# EAGLE design EdisonCandle (EAGLE 8.1.0)
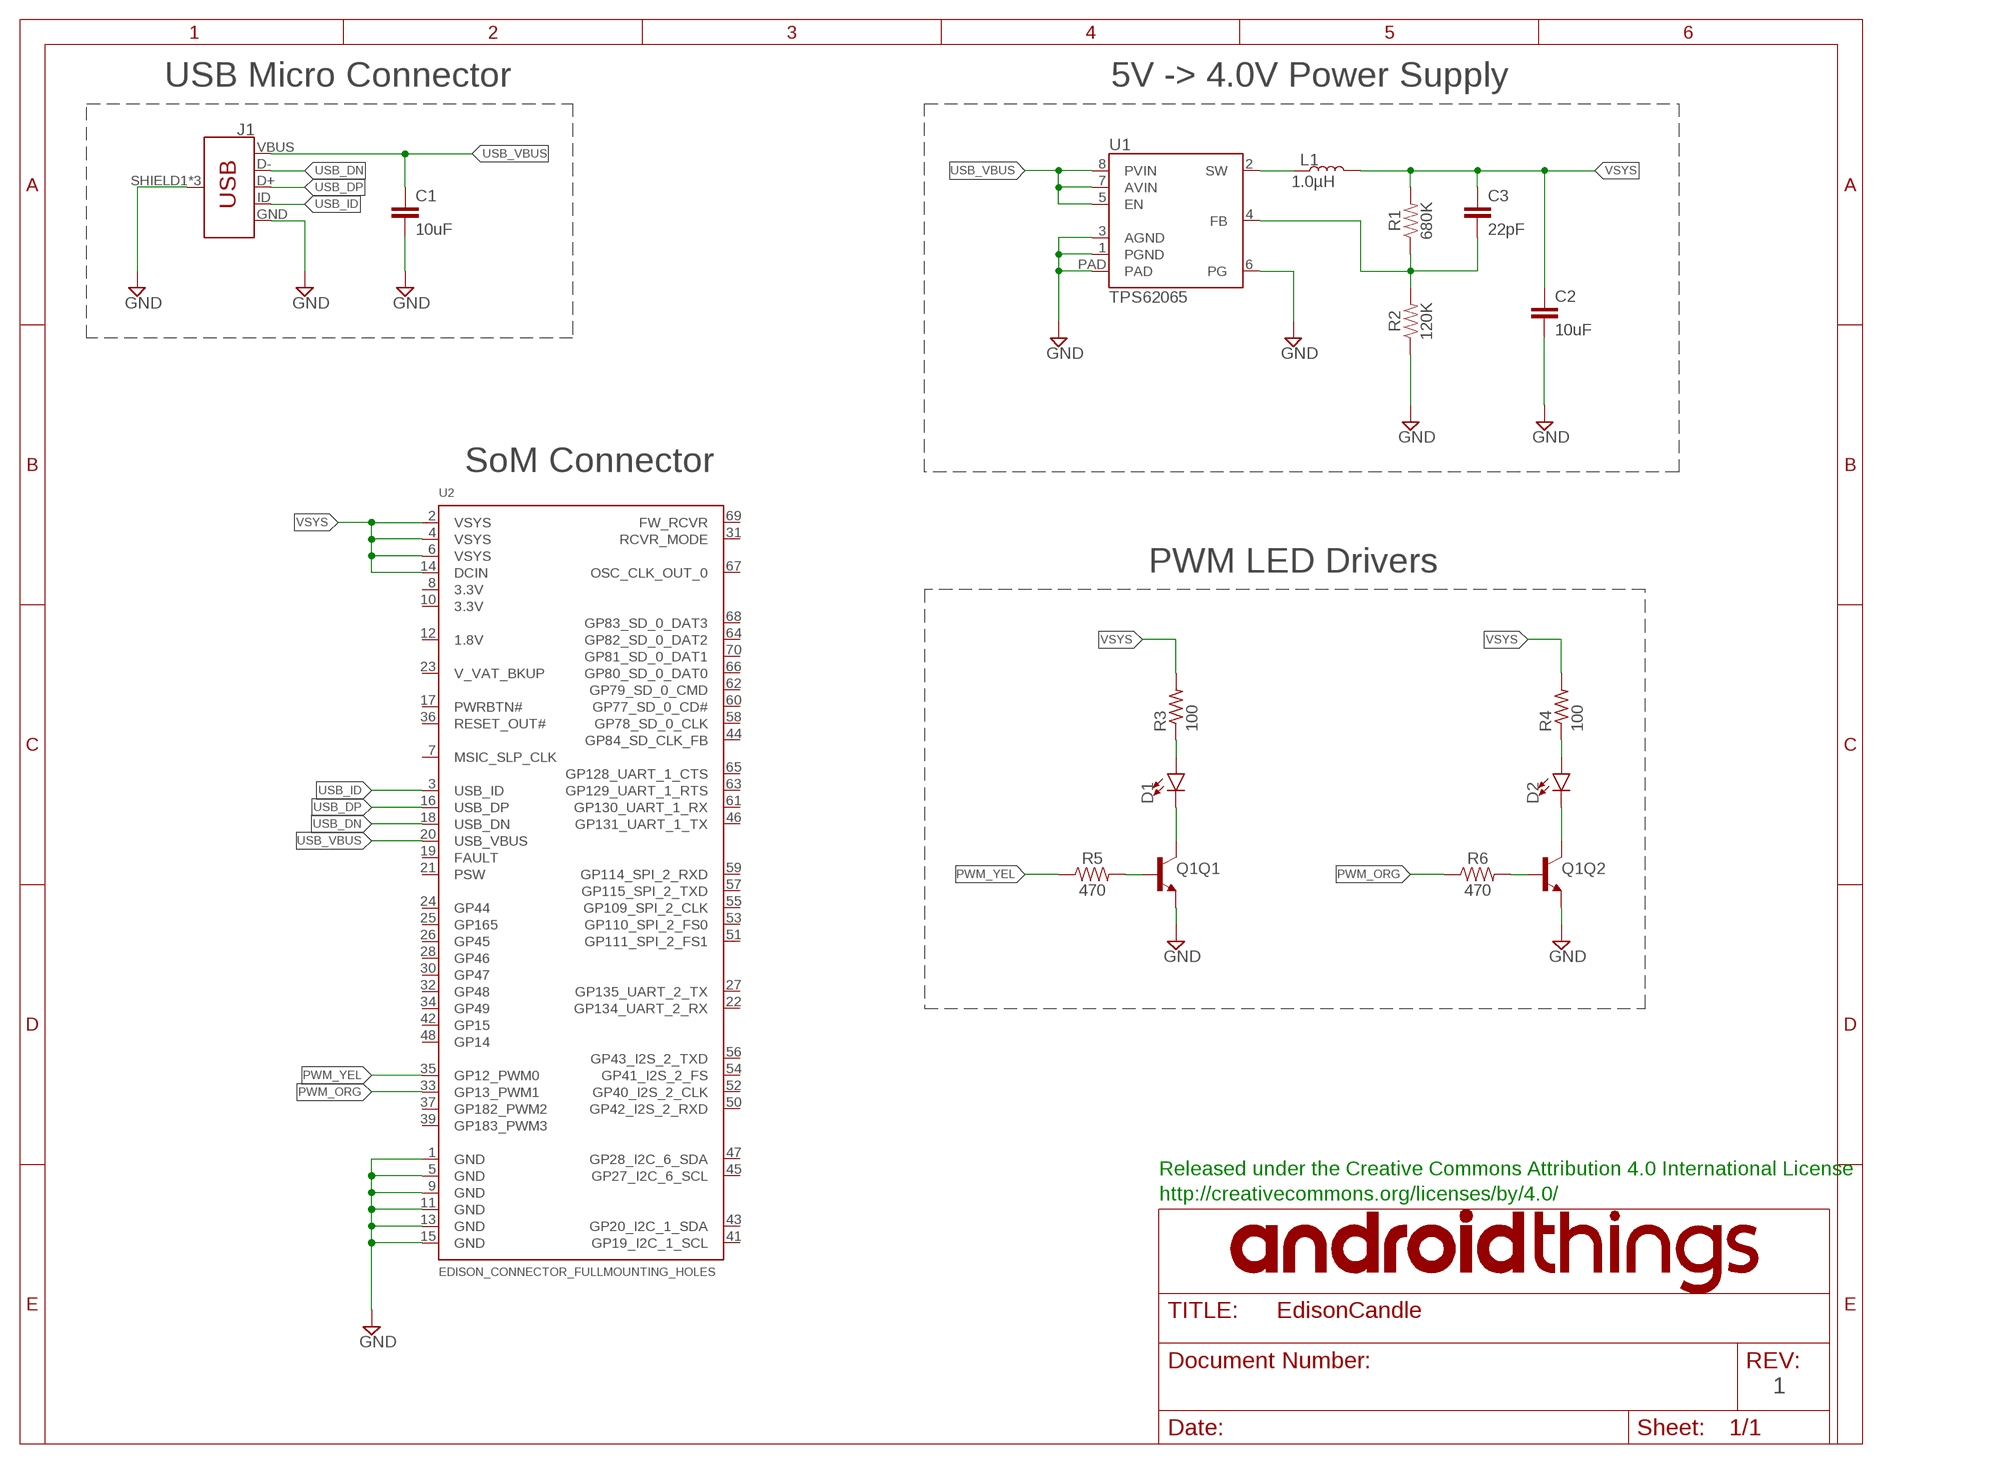
[diagram p0: schematic, sheet 1]

## Parts
C1  10uF  10UF-0805-10V-10%  [0805]
C2  10uF  10UF-0805-10V-10%  [0805]
C3  22pF  22PF-0603-50V-5%  [0603]
D1  LED10MM  [LED_10MM]
D2  LED10MM  [LED_10MM]
J1  USB_MICRO-B_FEMALE-SMT  [USB-B-MICRO-SMD]
L1  1.0µH  INDUCTOR-SRP4020-1UH  [SRP4020]
Q1  TRANS_NPN_DUAL-MBT3904DW1T1  [SC70-6]
R1  680K  680OHM-0603-1/10W-5%  [0603]
R2  120K  180OHM-0603-1/10W-1%  [0603]
R3  100  R-US_M1206  [M1206]
R4  100  R-US_M1206  [M1206]
R5  470  470OHM-0603-1/10W-1%  [0603]
R6  470  470OHM-0603-1/10W-1%  [0603]
U1  TPS62065  [WSON-8-PAD]
U2  EDISON_CONNECTOR_FULLMOUNTING_HOLES  [EDISON_DAUGHTER]

## Nets
GND: C1.2 C2.2 J1.GND J1.SHIELD1(SHIELD) J1.SHIELD2(SHIELD) J1.SHIELD3(SHIELD) Q1.1(Q2:E) Q1.4(Q1:E) R2.1 U1.1(PGND) U1.3(AGND) U1.6(PG) U1.PAD U2.1(GND) U2.5(GND) U2.9(GND) U2.11(GND) U2.13(GND) U2.15(GND)
N$1: L1.1 U1.2(SW)
N$2: D1.A R3.1
N$3: C3.2 R1.1 R2.2 U1.4(FB)
N$4: D2.A R4.1
N$5: D1.C Q1.3(Q1:C)
N$6: D2.C Q1.6(Q2:C)
N$7: Q1.5(Q1:B) R5.2
N$8: Q1.2(Q2:B) R6.2
PWM_ORG: R6.1 U2.33(GP13_PWM1)
PWM_YEL: R5.1 U2.35(GP12_PWM0)
USB_DN: J1.D- U2.18(USB_DN)
USB_DP: J1.D+ U2.16(USB_DP)
USB_ID: J1.ID U2.3(USB_ID)
USB_VBUS: C1.1 J1.VBUS U1.5(EN) U1.7(AVIN) U1.8(PVIN) U2.20(USB_VBUS)
VSYS: C2.1 C3.1 L1.2 R1.2 R3.2 R4.2 U2.2(VSYS) U2.4(VSYS) U2.6(VSYS) U2.14(DCIN)
Unconnected: U2.7(MSIC_SLP_CLK) U2.8(3.3V) U2.10(3.3V) U2.12(1.8V) U2.17(PWRBTN#) U2.19(FAULT) U2.21(PSW) U2.22(GP134_UART_2_RX) U2.23(V_VAT_BKUP) U2.24(GP44) U2.25(GP165) U2.26(GP45) U2.27(GP135_UART_2_TX) U2.28(GP46) U2.30(GP47) U2.31(RCVR_MODE) U2.32(GP48) U2.34(GP49) U2.36(RESET_OUT#) U2.37(GP182_PWM2) U2.39(GP183_PWM3) U2.41(GP19_I2C_1_SCL) U2.42(GP15) U2.43(GP20_I2C_1_SDA) U2.44(GP84_SD_CLK_FB) U2.45(GP27_I2C_6_SCL) U2.46(GP131_UART_1_TX) U2.47(GP28_I2C_6_SDA) U2.48(GP14) U2.50(GP42_I2S_2_RXD) U2.51(GP111_SPI_2_FS1) U2.52(GP40_I2S_2_CLK) U2.53(GP110_SPI_2_FS0) U2.54(GP41_I2S_2_FS) U2.55(GP109_SPI_2_CLK) U2.56(GP43_I2S_2_TXD) U2.57(GP115_SPI_2_TXD) U2.58(GP78_SD_0_CLK) U2.59(GP114_SPI_2_RXD) U2.60(GP77_SD_0_CD#) U2.61(GP130_UART_1_RX) U2.62(GP79_SD_0_CMD) U2.63(GP129_UART_1_RTS) U2.64(GP82_SD_0_DAT2) U2.65(GP128_UART_1_CTS) U2.66(GP80_SD_0_DAT0) U2.67(OSC_CLK_OUT_0) U2.68(GP83_SD_0_DAT3) U2.69(FW_RCVR) U2.70(GP81_SD_0_DAT1)

## Notes on the sheet
- USB Micro Connector | 5V -> 4.0V Power Supply
- SoM Connector
- PWM LED Drivers
- Released under the Creative Commons Attribution 4.0 International License
- http://creativecommons.org/licenses/by/4.0/
- 1

## Library data of the parts
C1 C2 = SparkFun-Capacitors:10UF: 10.0µF ceramic capacitors A capacitor is a passive two-terminal electrical component used to store electrical energy temporarily in an electric field.; MPN: GRM21BR71A106KE51K; PROD_ID: CAP-11330
C3 = SparkFun-Capacitors:22PF: 22pF ceramic capacitors A capacitor is a passive two-terminal electrical component used to store electrical energy temporarily in an electric field.; MPN: 06035C220JAT2A; PROD_ID: CAP-07876
D1 D2 = SparkFun-LED:LED: LED (Generic) Standard schematic elements and footprints for 5mm, 3mm, 1206, and 0603 sized LEDs. Generic LEDs with no color specified.
J1 = SparkFun-Connectors:USB_MICRO-B: USB Type Micro-B Connector Male/female and PTH/SMT variants SparkFun Products: SparkFun microB USB Breakout <https://www.sparkfun.com/products/12035> SparkFun USB microB Plug Breakout <https://www.sparkfun.com/products/10031> SparkFun ESP8266 Thing <https://www.sparkfun.com/products/13231>; MPN: 10104110-0001LF; PROD_ID: CONN-11752
L1 = SparkFun-Coils:INDUCTOR: Inductors Resist changes in electrical current. Basically a coil of wire. SparkFun Products: SparkFun Load Cell Amplifier - HX711 <https://www.sparkfun.com/products/13879> IOIO-OTG - V2.2 <https://www.sparkfun.com/products/13613>; MPN: SRP4020-1R0M; VALUE: 1µH/±20%/5A
Q1 = SparkFun-DiscreteSemi:TRANS_NPN_DUAL: Dual NPN Transistors in Single Package The MBT3904W1 puts two general purpose 3904 NPN transistors in a single package. Datasheet <http://www.onsemi.com/pub_link/Collateral/MBT3904DW1T1-D.PDF> SparkFun Products: SparkFun ESP32 Thing <https://www.sparkfun.com/products/13907>; MPN: MBT3904DW1T1G; PROD_ID: TRANS-13337
R1 = SparkFun-Resistors:680OHM: 680Ω resistor A resistor is a passive two-terminal electrical component that implements electrical resistance as a circuit element. Resistors act to reduce current flow, and, at the same time, act to lower voltage levels within circuits. - Wikipedia; MPN: ERJ-3EKF6803V; PROD_ID: RES-09333; VALUE: 680
R2 = SparkFun-Resistors:180OHM: 180Ω resistor A resistor is a passive two-terminal electrical component that implements electrical resistance as a circuit element. Resistors act to reduce current flow, and, at the same time, act to lower voltage levels within circuits. - Wikipedia; MPN: ERJ-3EKF1203V; PROD_ID: RES-08788; VALUE: 180
R3 R4 = resistor:R-US_: RESISTOR, American symbol; MPN: RC1206FR-07100RL
R5 R6 = SparkFun-Resistors:470OHM: 470Ω resistor A resistor is a passive two-terminal electrical component that implements electrical resistance as a circuit element. Resistors act to reduce current flow, and, at the same time, act to lower voltage levels within circuits. - Wikipedia; MPN: ERJ-3EKF4700V; PROD_ID: RES-07869
U1 = SparkFun-IC-Power:TPS62065: TPS62065 DC/DC step-Down regulator.; MPN: TPS62065DSGR; PROD_ID: IC-12273
U2 = Edison:EDISON_CONNECTOR_FULL; MPN: DF40HC(3.0)-70DS-0.4V(58)

## Board
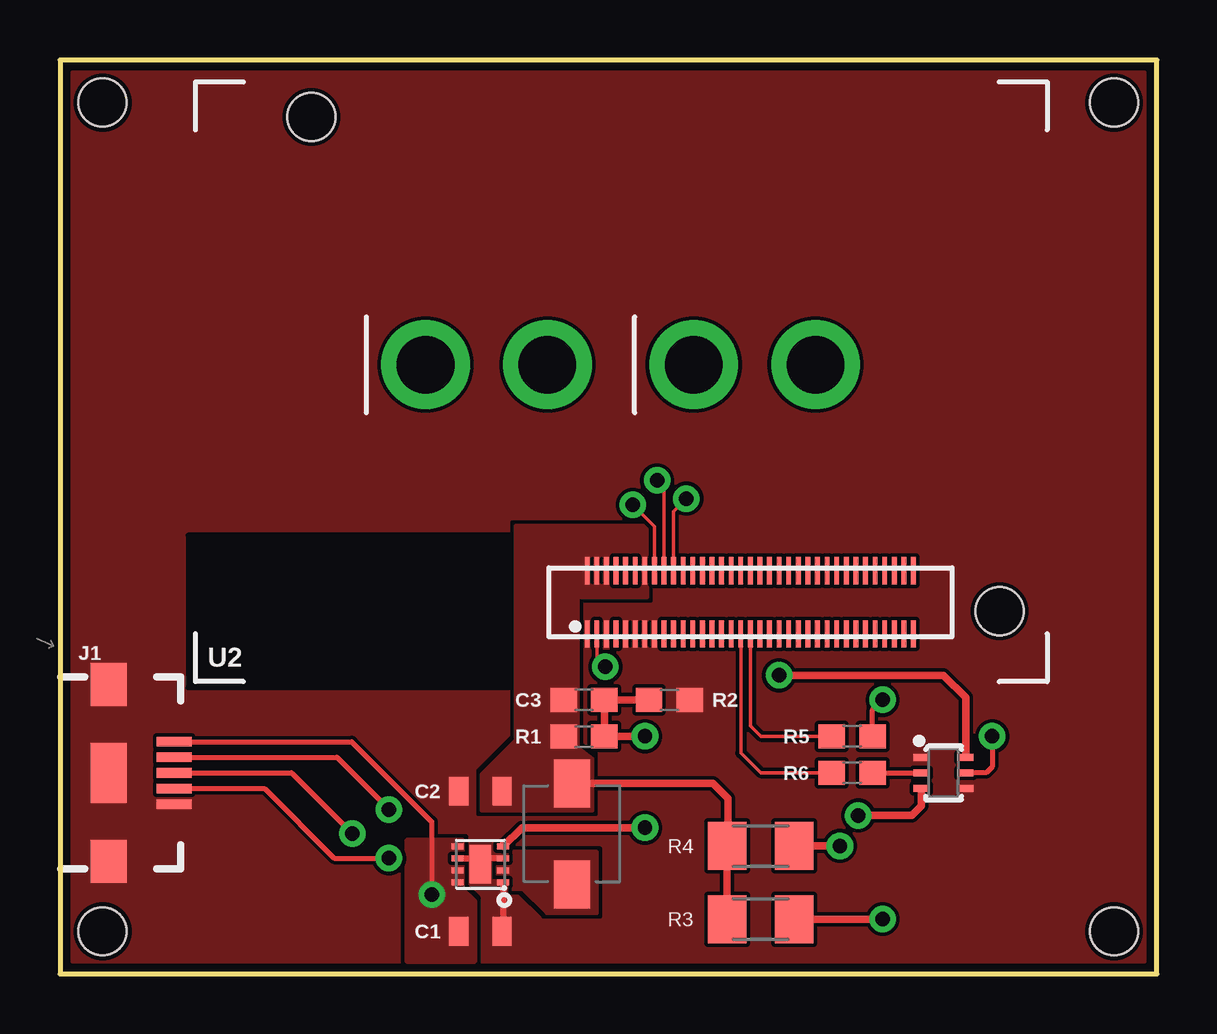
[diagram p1: board, top side]
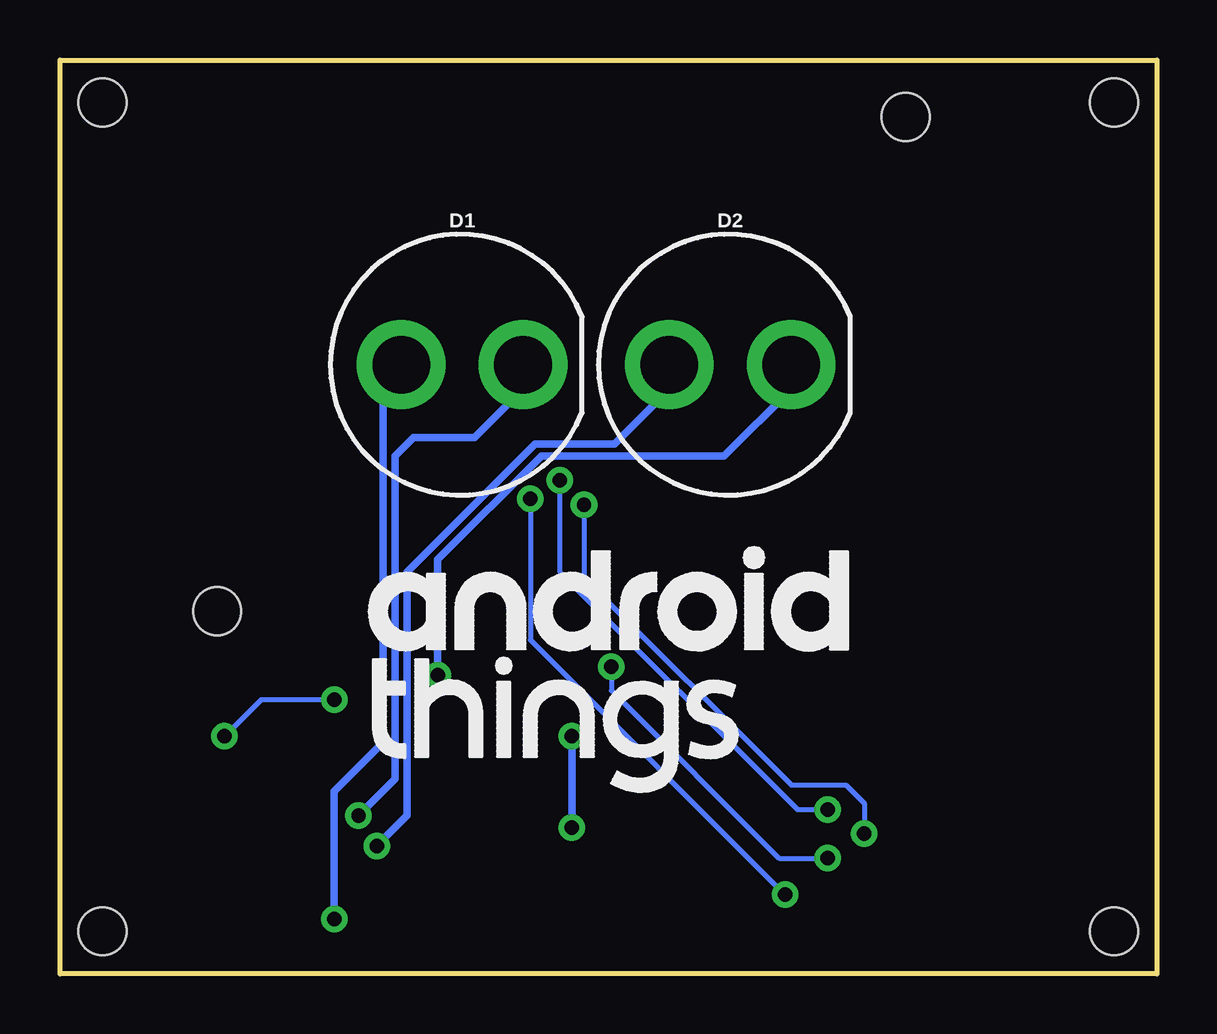
[diagram p2: board, bottom side, seen from below]

Size 45.72 x 38.1 mm. Coordinates in mm from the lower left corner, seen from the top.
Outline: 0,0 45.72,0 45.72,38.1 0,38.1 0,0
Copper layers (1*16): Top 0.035mm / dielectric 1.5mm / Bottom 0.035mm
Design rules "SparkFun *": minimum track width 6mil, minimum drill 20mil, track to track 6mil, track to pad 6mil, pad to pad 6mil, via to via 6mil, smd to smd 6mil, copper to edge 8mil, drill to drill 8mil, minimum pad ring 12mil, minimum via ring 10mil, stop-mask expansion 4mil, vias tented up to drill 20mil, thermal gap 10mil
Holes 2 mm at 1.78,36.32 43.94,36.32 43.94,1.78 1.78,1.78

### Footprints (pad centres in the part's own frame; a part is rotated, then mirrored left to right if it is on the bottom)
0805 = smd 0.8 x 1.2: 1 -0.9,0; 2 0.9,0
0603 = smd 1.1 x 1: 1 -0.85,0; 2 0.85,0
LED_10MM = drill 2.4 pad 3.7: A 2.54,0; C -2.54,0
USB-B-MICRO-SMD = smd 1.45 x 0.4: D+ 2.725,0; D- 2.725,0.65; GND 2.725,-1.3; ID 2.725,-0.65; VBUS 2.725,1.3 | smd 1.5 x 1.8: SHIELD1 0,3.685; SHIELD2 0,-3.685 | smd 1.5 x 2.5: SHIELD3 0,0
SRP4020 = smd 2 x 1.5: 1 -2.1,0; 2 2.1,0
SC70-6 = smd 0.3 x 0.66: 1 -0.65,-0.92; 2 0,-0.92; 3 0.65,-0.92; 4 0.65,0.92; 5 0,0.92; 6 -0.65,0.92
M1206 = smd 1.6 x 2: 1 -1.4,0; 2 1.4,0
WSON-8-PAD = smd 0.25 x 0.5: 1 -0.75,-0.95; 2 -0.25,-0.95; 3 0.25,-0.95; 4 0.75,-0.95; 5 0.75,0.95; 6 0.25,0.95; 7 -0.25,0.95; 8 -0.75,0.95 | smd 1.6 x 0.9: PAD 0,0
EDISON_DAUGHTER = smd 1.14 x 0.2: 1 1.98,19.17; 2 4.62,19.17; 3 1.98,18.77; 4 4.62,18.77; 5 1.98,18.37; 6 4.62,18.37; 7 1.98,17.97; 8 4.62,17.97; 9 1.98,17.57; 10 4.62,17.57; 11 1.98,17.17; 12 4.62,17.17; 13 1.98,16.77; 14 4.62,16.77; 15 1.98,16.37; 16 4.62,16.37; 17 1.98,15.97; 18 4.62,15.97; 19 1.98,15.57; 20 4.62,15.57; 21 1.98,15.17; 22 4.62,15.17; 23 1.98,14.77; 24 4.62,14.77; 25 1.98,14.37; 26 4.62,14.37; 27 1.98,13.97; 28 4.62,13.97; 29 1.98,13.57; 30 4.62,13.57; 31 1.98,13.17; 32 4.62,13.17; 33 1.98,12.77; 34 4.62,12.77; 35 1.98,12.37; 36 4.62,12.37; 37 1.98,11.97; 38 4.62,11.97; 39 1.98,11.57; 40 4.62,11.57; 41 1.98,11.17; 42 4.62,11.17; 43 1.98,10.77; 44 4.62,10.77; 45 1.98,10.37; 46 4.62,10.37; 47 1.98,9.97; 48 4.62,9.97; 49 1.98,9.57; 50 4.62,9.57; 51 1.98,9.17; 52 4.62,9.17; 53 1.98,8.77; 54 4.62,8.77; 55 1.98,8.37; 56 4.62,8.37; 57 1.98,7.97; 58 4.62,7.97; 59 1.98,7.57; 60 4.62,7.57; 61 1.98,7.17; 62 4.62,7.17; 63 1.98,6.77; 64 4.62,6.77; 65 1.98,6.37; 66 4.62,6.37; 67 1.98,5.97; 68 4.62,5.97; 69 1.98,5.57; 70 4.62,5.57 | hole 2: 23.53,30.67; 2.93,1.98

### Placement (x,y rotation side)
C1  17.53,1.78 0 top
C2  17.53,7.62 180 top
C3  21.84,11.43 0 top
D1  28.96,25.4 180 bottom
D2  17.78,25.4 180 bottom
J1  2.03,8.38 0 top
L1  21.34,5.84 90 top
Q1  36.83,8.38 270 top
R1  21.84,9.91 180 top
R2  25.4,11.43 180 top
R3  29.21,2.29 180 top
R4  29.21,5.33 180 top
R5  33.02,9.91 0 top
R6  33.02,8.38 0 top
U1  17.53,4.57 90 top
U2  41.15,12.19 90 top
U$2  [ATHINGS_LOGO_STACKED_20MM]  22.86,12.7 0 bottom

### Tracks (layer width: path | path; a pad name or v marks a point on that pad's centre or on a via)
GND
  Top 0.254: U1.6 17.28,4.82 U1.PAD 17.78,4.82 U1.3 | U1.1 18.48,1.83 C1.2
  pour Top (rank 6, no thermals): 0.51,0.51 45.21,0.51 45.21,37.59 0.51,37.59
  cutout Top: 18.8,18.29 5.33,18.29 5.33,11.94 18.8,11.94
N$1
  pour Top (no thermals): 22.35,5.08 22.35,2.54 20.32,2.54 19.3,3.56 18.29,3.56 18.29,5.08
N$2  (via drill 0.6)
  Top 0.305: v34.29,2.29 R3.1
  Bottom 0.305: v34.29,2.29 34.29,7.62 32.26,9.65 32.26,24.64 D1.A
N$3  (via drill 0.6)
  Top 0.305: R2.2 C3.2 R1.1 v24.38,9.91 | 18.44,5.36 U1.4 19.25,6.1 v24.38,6.1
  Bottom 0.305: v24.38,9.91 v24.38,6.1
N$4  (via drill 0.6)
  Top 0.305: v32.51,5.33 R4.1
  Bottom 0.305: v32.51,5.33 31.24,6.6 31.24,16.76 25.91,22.1 22.61,22.1 20.32,24.38 D2.A
N$5  (via drill 0.6)
  Top 0.305: v33.27,6.6 35.51,6.6 35.92,7.01 Q1.3
  Bottom 0.305: v33.27,6.6 31.75,8.13 31.75,21.59 30.99,22.35 28.45,22.35 26.42,24.38 D1.C
N$6  (via drill 0.6)
  Top 0.305: Q1.6 37.75,11.53 36.83,12.45 v29.97,12.45
  Bottom 0.305: v29.97,12.45 29.97,17.27 25.65,21.59 18.03,21.59 15.24,24.38 D2.C
N$7  (via drill 0.6)
  Top 0.203: R5.2 33.87,11.01 v34.29,11.43 | v38.86,9.91 38.86,8.64 38.61,8.38 Q1.5
  Bottom 0.203: v34.29,11.43 37.34,11.43 v38.86,9.91
N$8
  Top 0.203: R6.2 Q1.2
PWM_ORG
  Top 0.152: U2.33 28.38,9.21 29.21,8.38 R6.1
PWM_YEL
  Top 0.152: U2.35 28.78,10.34 29.21,9.91 R5.1
USB_DN  (via drill 0.6)
  Top 0.152: U2.18 25.18,20.29 v24.89,20.57
  Top 0.203: J1.D- 11.54,9.03 v13.72,6.86
  Bottom 0.203: v24.89,20.57 24.89,16.76 14.99,6.86 v13.72,6.86
USB_DP  (via drill 0.6)
  Top 0.152: U2.16 24.78,18.66 v23.88,19.56
  Top 0.203: J1.D+ 9.65,8.38 v12.19,5.84
  Bottom 0.203: v23.88,19.56 23.88,16.51 15.24,7.87 12.95,7.87 12.19,7.11 v12.19,5.84
USB_ID  (via drill 0.6)
  Top 0.152: U2.3 22.38,13.16 v22.73,12.8
  Top 0.203: v13.72,4.83 11.43,4.83 8.52,7.73 J1.ID
  Bottom 0.203: 22.71,12.8 v22.73,12.8 22.73,11.81 15.75,4.83 v13.72,4.83
USB_VBUS  (via drill 0.6)
  Top 0.152: U2.20 25.58,19.28 v26.11,19.81
  Top 0.203: v15.49,3.3 15.49,6.35 12.16,9.68 J1.VBUS
  Bottom 0.203: v26.11,19.81 26.11,13.92 v15.49,3.3
  pour Top (no thermals): 17.27,0.51 14.48,0.51 14.48,5.59 16.76,5.59 16.76,3.56 17.27,3.05
VSYS
  Top 0.305: L1.2 27.21,7.94 27.84,7.32 27.84,5.36 R4.2 R3.2
  pour Top (no thermals): 17.58,6.81 22.2,6.81 22.2,8.99 21.59,9.45 21.59,15.7 24.49,15.7 24.49,18.69 19,18.69 19,9.75 17.58,8.33

### Text on the board
tDocu: Released under the Creative Commons Attribution 4.0 International License | http://creativecommons.org/licenses/by/4.0/